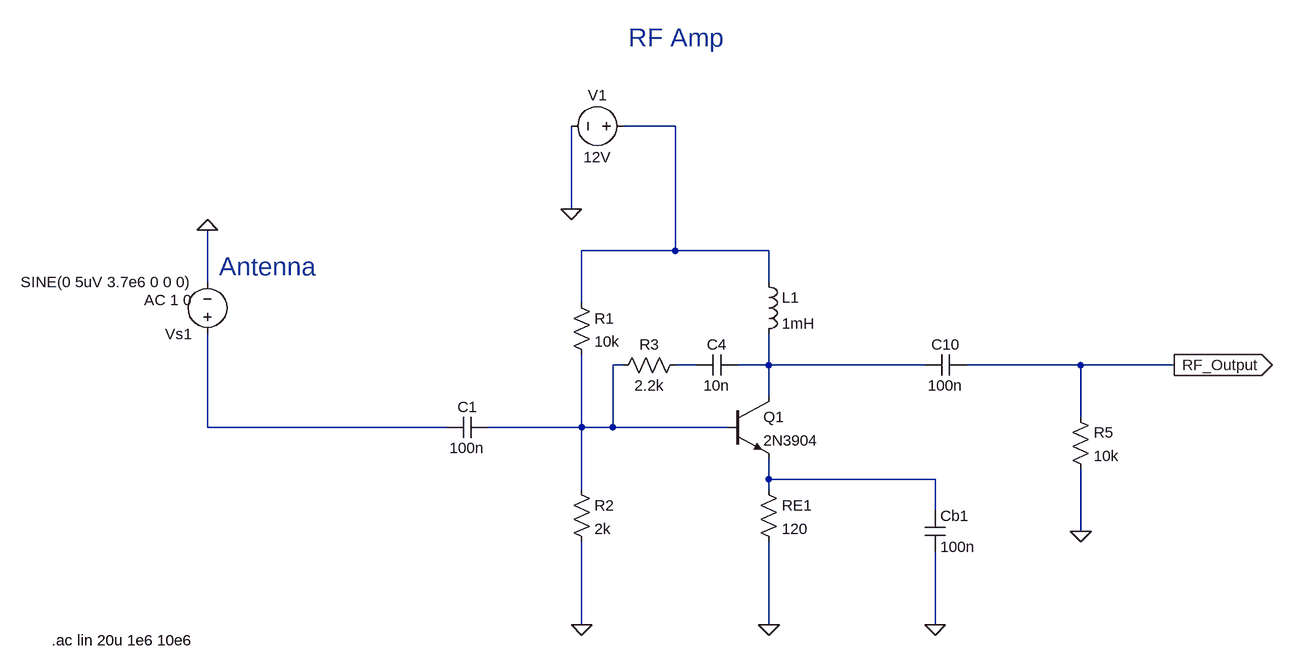
[diagram p0: schematic RF Amp.asc]
RF Amp.asc, the LTspice schematic file:
Version 4
SHEET 1 1400 712
WIRE -320 -96 -400 -96
WIRE -480 32 -480 -96
WIRE -320 96 -320 -96
WIRE -320 96 -464 96
WIRE -176 96 -320 96
WIRE -1040 144 -1040 64
WIRE -176 144 -176 96
WIRE -464 176 -464 96
WIRE -400 272 -416 272
WIRE -288 272 -320 272
WIRE -176 272 -176 224
WIRE -176 272 -224 272
WIRE 64 272 -176 272
WIRE 304 272 128 272
WIRE 448 272 304 272
WIRE -176 320 -176 272
WIRE 304 352 304 272
WIRE -1040 368 -1040 224
WIRE -672 368 -1040 368
WIRE -464 368 -464 256
WIRE -464 368 -608 368
WIRE -416 368 -416 272
WIRE -416 368 -464 368
WIRE -240 368 -416 368
WIRE -176 448 -176 416
WIRE 80 448 -176 448
WIRE -464 464 -464 368
WIRE -176 464 -176 448
WIRE 80 496 80 448
WIRE 304 528 304 432
WIRE -464 672 -464 544
WIRE -176 672 -176 544
WIRE 80 672 80 560
FLAG -480 32 0
FLAG -1040 64 0
FLAG -464 672 0
FLAG -176 672 0
FLAG 80 672 0
FLAG 304 528 0
FLAG 448 272 RF_Output
IOPIN 448 272 Out
SYMBOL voltage -384 -96 R90
WINDOW 0 -32 56 VBottom 2
WINDOW 3 32 56 VTop 2
WINDOW 123 0 0 Left 2
WINDOW 39 0 0 Left 2
SYMATTR InstName V1
SYMATTR Value 12V
SYMBOL res -480 160 R0
SYMATTR InstName R1
SYMATTR Value 10k
SYMBOL res -480 448 R0
SYMATTR InstName R2
SYMATTR Value 2k
SYMBOL res -192 448 R0
SYMATTR InstName RE1
SYMATTR Value 120
SYMBOL npn -240 320 R0
SYMATTR InstName Q1
SYMATTR Value 2N3904
SYMBOL voltage -1040 240 R180
WINDOW 123 24 68 Left 2
WINDOW 39 0 0 Left 2
SYMATTR Value2 AC 1 0
SYMATTR InstName Vs1
SYMATTR Value SINE(0 5uV 3.7e6 0 0 0)
SYMBOL cap -608 352 R90
WINDOW 0 0 32 VBottom 2
WINDOW 3 32 32 VTop 2
SYMATTR InstName C1
SYMATTR Value 100n
SYMBOL cap 64 496 R0
SYMATTR InstName Cb1
SYMATTR Value 100n
SYMBOL cap -224 256 R90
WINDOW 0 0 32 VBottom 2
WINDOW 3 32 32 VTop 2
SYMATTR InstName C4
SYMATTR Value 10n
SYMBOL res -304 256 R90
WINDOW 0 0 56 VBottom 2
WINDOW 3 32 56 VTop 2
SYMATTR InstName R3
SYMATTR Value 2.2k
SYMBOL ind -192 128 R0
SYMATTR InstName L1
SYMATTR Value 1mH
SYMBOL cap 128 256 R90
WINDOW 0 0 32 VBottom 2
WINDOW 3 32 32 VTop 2
SYMATTR InstName C10
SYMATTR Value 100n
SYMBOL res 288 336 R0
SYMATTR InstName R5
SYMATTR Value 10k
TEXT -872 120 Right 4 ;Antenna
TEXT -392 -232 Left 4 ;RF Amp
TEXT -1280 696 Left 2 !.ac lin 20u 1e6 10e6

The netlist it stands for:
* RF Amp.asc
V1 N001 0 12V
R1 N001 N002 10k
R2 N002 0 2k
RE1 N006 0 120
Q1 N004 N002 N006 0 2N3904
Vs1 N005 0 SINE(0 5uV 3.7e6 0 0 0) AC 1 0
C1 N002 N005 100n
Cb1 N006 0 100n
C4 N004 N003 10n
R3 N003 N002 2.2k
L1 N001 N004 1mH
C10 RF_Output N004 100n
R5 RF_Output 0 10k
.model NPN NPN
.model PNP PNP
.lib standard.bjt
* Antenna
* RF Amp
.ac lin 20u 1e6 10e6
.backanno
.end